# EAGLE design schematic (EAGLE 9.6.2)
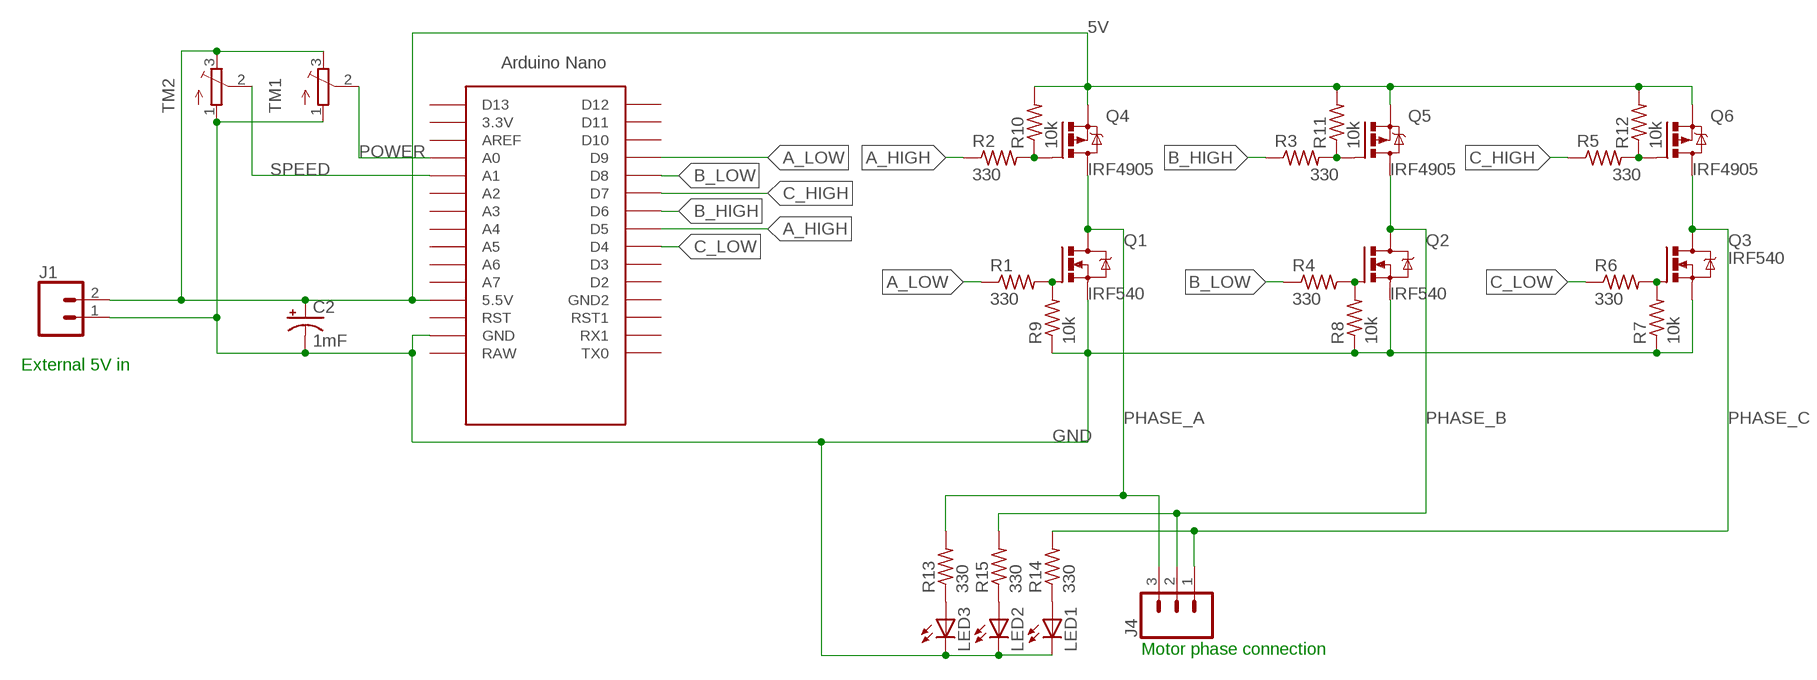
[diagram p0: schematic, sheet 1]

## Parts
C2  1mF  1000UF-RADIAL-5MM-25V-20%  [CPOL-RADIAL-5MM-10MM]
J1  CONN_025MM  [SCREWTERMINAL-5MM-2]
J4  CONN_03-SCREW-5MM  [SCREWTERMINAL-5MM-3]
LED1  LED5MM  [LED5MM]
LED2  LED5MM  [LED5MM]
LED3  LED5MM  [LED5MM]
Q1  IRF540  [TO220BV]
Q2  IRF540  [TO220BV]
Q3  IRF540  [TO220BV]
Q4  IRF4905  [TO220BH]
Q5  IRF4905  [TO220BH]
Q6  IRF4905  [TO220BH]
R1  330  R-US_0204/5  [0204/5]
R2  330  R-US_0204/5  [0204/5]
R3  330  R-US_0204/5  [0204/5]
R4  330  R-US_0204/5  [0204/5]
R5  330  R-US_0204/5  [0204/5]
R6  330  R-US_0204/5  [0204/5]
R7  10k  R-US_0204/5  [0204/5]
R8  10k  R-US_0204/5  [0204/5]
R9  10k  R-US_0204/5  [0204/5]
R10  10k  R-US_0204/5  [0204/5]
R11  10k  R-US_0204/5  [0204/5]
R12  10k  R-US_0204/5  [0204/5]
R13  330  R-US_0204/5  [0204/5]
R14  330  R-US_0204/5  [0204/5]
R15  330  R-US_0204/5  [0204/5]
TM1  TRIMPOT3386  [TRIM-3386]
TM2  TRIMPOT3386  [TRIM-3386]
U$1  NANO  [NANO]

## Nets
5V: C2.+ J1.2 Q4.S Q5.S Q6.S R10.2 R11.2 R12.2 TM1.3(E) TM2.3(E) U$1.5V(5.5V)
A_HIGH: R2.1 U$1.D5
A_LOW: R1.1 U$1.D9
B_HIGH: R3.1 U$1.D6
B_LOW: R4.1 U$1.D8
C_HIGH: R5.1 U$1.D7
C_LOW: R6.1 U$1.D4
GND: C2.- J1.1 LED1.K(C) LED2.K(C) LED3.K(C) Q1.S Q2.S Q3.S R7.1 R8.1 R9.1 TM1.1(A) TM2.1(A) U$1.GND
N$1: Q1.G R1.2 R9.2
N$2: Q4.G R2.2 R10.1
N$3: Q5.G R3.2 R11.1
N$4: Q2.G R4.2 R8.2
N$5: Q6.G R5.2 R12.1
N$6: Q3.G R6.2 R7.2
N$12: LED1.A R14.1
N$13: LED2.A R15.1
N$20: LED3.A R13.1
PHASE_A: J4.3 Q1.D Q4.D R13.2
PHASE_B: J4.2 Q2.D Q5.D R15.2
PHASE_C: J4.1 Q3.D Q6.D R14.2
POWER: TM1.2(S) U$1.A0
SPEED: TM2.2(S) U$1.A1
Unconnected: U$1.3.3V U$1.A2 U$1.A3 U$1.A4 U$1.A5 U$1.A6 U$1.A7 U$1.AREF U$1.D2 U$1.D3 U$1.D10 U$1.D11 U$1.D12 U$1.D13 U$1.GND1(GND2) U$1.ICSP1 U$1.ICSP2 U$1.ICSP3 U$1.ICSP4 U$1.ICSP5 U$1.ICSP6 U$1.RAW U$1.RST U$1.RST1 U$1.RX1 U$1.TX0

## Notes on the sheet
- External 5V in
- Motor phase connection

## Library data of the parts
C2 = SparkFun-Capacitors:1000UF: 1,000µF/1mF ceramic capacitors A capacitor is a passive two-terminal electrical component used to store electrical energy temporarily in an electric field. CAP-08070; PROD_ID: CAP-09538
J1 = SparkFun-Connectors:CONN_02: Multi connection point. Often used as Generic Header-pin footprint for 0.1 inch spaced/style header connections On any of the 0.1 inch spaced packages, you can populate with these: Break Away Headers - Straight <https://www.sparkfun.com/products/116> (PRT-00116) Break Away Male Headers - Right Angle <https://www.sparkfun.com/products/553> (PRT-00553) Female Headers <https://www.sparkfun.com/products/115> (PRT-00115) Break Away Headers - Machine Pin <https://www.sparkfun.com/products/117> (PRT-00117) Break Away Female Headers - Swiss Machine Pin <https://www.sparkfun.com/products/743> (PRT-00743) For SCREWTERMINALS and SPRING TERMINALS visit here: Screw Terimnals on SparkFun.com <https://www.sparkfun.com/search/results?term=Screw+Terminals> (5mm/3.5mm/2.54mm spacing) This device is also useful as a general connection point to wire up your design to another part of your project. Our various solder wires solder well into these plated through hole pads. Hook-Up Wire - Assortment (Stranded, 22 AWG) <https://www.sparkfun.com/products/11375> (PRT-11375) Hook-Up Wire - Assortment (Solid Core, 22 AWG) <https://www.sparkfun.com/products/11367> (PRT-11367) View the entire wire category on our website here <https://www.sparkfun.com/categories/141> Special notes: Molex polarized connector foot print use with: PRT-08233 with associated crimp pins and housings. 2.54_SCREWTERM for use with PRT-10571. 3.5mm Screw Terminal footprints for PRT-08084 5mm Screw Terminal footprints for use with PRT-08432; SF_SKU: PRT-08432
J4 = SparkFun-Connectors:CONN_03: Multi connection point. Often used as Generic Header-pin footprint for 0.1 inch spaced/style header connections On any of the 0.1 inch spaced packages, you can populate with these: Break Away Headers - Straight <https://www.sparkfun.com/products/116> (PRT-00116) Break Away Male Headers - Right Angle <https://www.sparkfun.com/products/553> (PRT-00553) Female Headers <https://www.sparkfun.com/products/115> (PRT-00115) Break Away Headers - Machine Pin <https://www.sparkfun.com/products/117> (PRT-00117) Break Away Female Headers - Swiss Machine Pin <https://www.sparkfun.com/products/743> (PRT-00743) Stackable Header - 3 Pin (Female, 0.1") <https://www.sparkfun.com/products/13875> (PRT-13875) For SCREWTERMINALS and SPRING TERMINALS visit here: Screw Terimnals on SparkFun.com <https://www.sparkfun.com/search/results?term=Screw+Terminals> (5mm/3.5mm/2.54mm spacing) This device is also useful as a general connection point to wire up your design to another part of your project. Our various solder wires solder well into these plated through hole pads. Hook-Up Wire - Assortment (Stranded, 22 AWG) <https://www.sparkfun.com/products/11375> (PRT-11375) Hook-Up Wire - Assortment (Solid Core, 22 AWG) <https://www.sparkfun.com/products/11367> (PRT-11367) View the entire wire category on our website here <https://www.sparkfun.com/categories/141> Special notes: Molex polarized connector foot print use with SKU : PRT-08232 with associated crimp pins and housings.; PROD_ID: CONN-10134; SF_SKU: PRT-08433
LED1-LED3 = adafruit:LED: LED OSRAM: - CHIPLED LG R971, LG N971, LY N971, LG Q971, LY Q971, LO R971, LY R971 LH N974, LH R974 LS Q976, LO Q976, LY Q976 LO Q996 - Hyper CHIPLED LW Q18S LB Q993, LB Q99A, LB R99A - SideLED LS A670, LO A670, LY A670, LG A670, LP A670 LB A673, LV A673, LT A673, LW A673 LH A674 LY A675 LS A676, LA A676, LO A676, LY A676, LW A676 LS A679, LY A679, LG A679 - Hyper Micro SIDELED® LS Y876, LA Y876, LO Y876, LY Y876 LT Y87S - SmartLED LW L88C, LW L88S LB L89C, LB L89S, LG L890 LS L89K, LO L89K, LY L89K LS L896, LA L896, LO L896, LY L896 - TOPLED LS T670, LO T670, LY T670, LG T670, LP T670 LSG T670, LSP T670, LSY T670, LOP T670, LYG T670 LG T671, LOG T671, LSG T671 LB T673, LV T673, LT T673, LW T673 LH T674 LS T676, LA T676, LO T676, LY T676, LB T676, LH T676, LSB T676, LW T676 LB T67C, LV T67C, LT T67C, LS T67K, LO T67K, LY T67K, LW E67C LS E67B, LA E67B, LO E67B, LY E67B, LB E67C, LV E67C, LT E67C LW T67C LS T679, LY T679, LG T679 LS T770, LO T770, LY T770, LG T770, LP T770 LB T773, LV T773, LT T773, LW T773 LH T774 LS E675, LA E675, LY E675, LS T675 LS T776, LA T776, LO T776, LY T776, LB T776 LHGB T686 LT T68C, LB T68C - Hyper Mini TOPLED® LB M676 - Mini TOPLED Santana® LG M470 LS M47K, LO M47K, LY M47K Source: http://www.osram.convergy.de/
Q1-Q3 = transistor-power:IRF540: HEXFET Power MOSFET
Q4-Q6 = transistor-power:IRF4905: P-Channel HEXFET® Power MOSFET RDS(on)= 0.02 Ohm, ID = -74A Source: http://www.irf.com/product-info/datasheets/data/irf4905pbf.pdf
R1-R15 = adafruit:R-US_: RESISTOR, American symbol
TM1 TM2 = adafruit:TRIMPOT: SMT trimmer potentiometer part number TC33X http://www.ladyada.net/library/eagle
U$1 = Arduino-clone:NANO: Arduino Nano

## Board
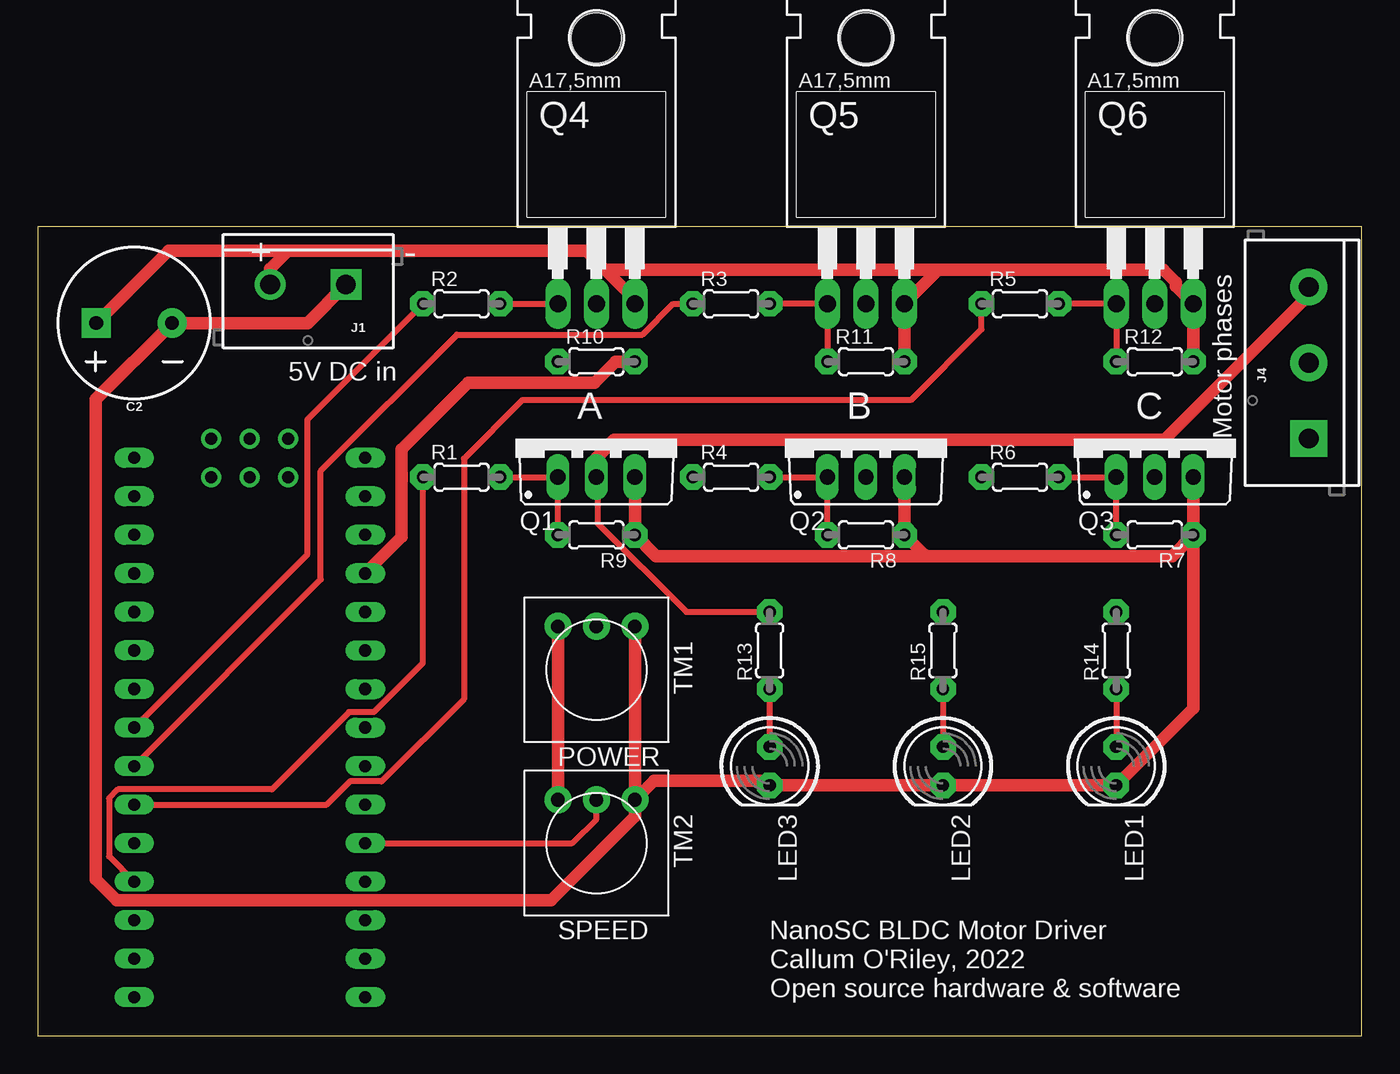
[diagram p1: board, top side]
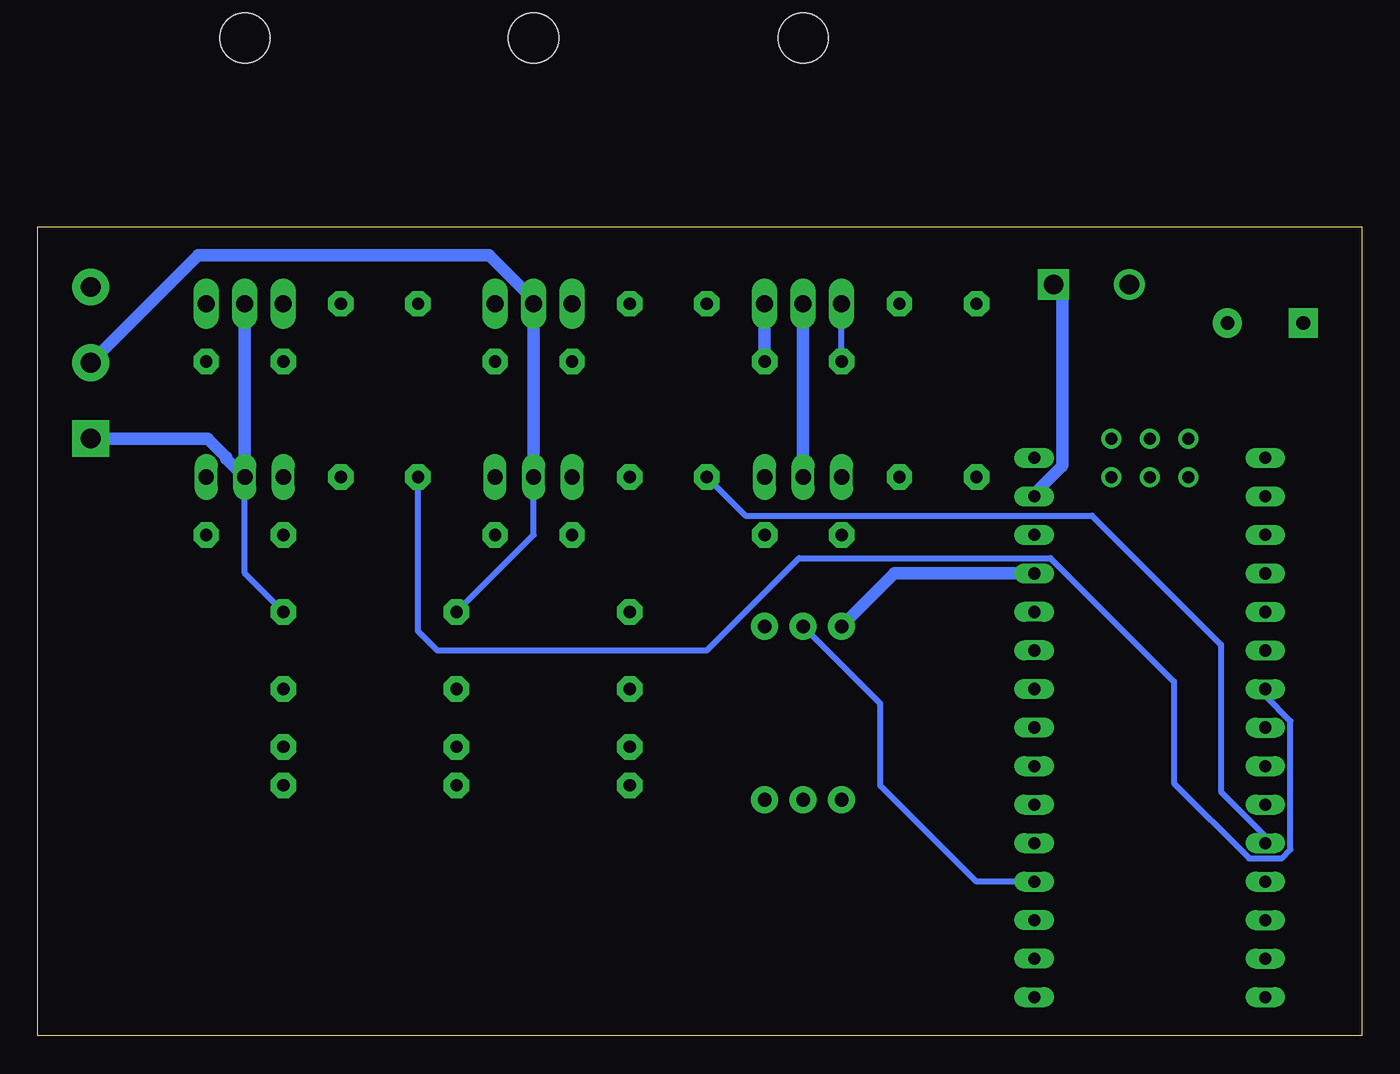
[diagram p2: board, bottom side, seen from below]

Size 87.3 x 53.33 mm. Coordinates in mm from the lower left corner, seen from the top.
Outline: 0,0 87.3,0 87.3,53.33 0,53.33 0,0
Copper layers (1*16): Top 0.035mm / dielectric 1.5mm / Bottom 0.035mm
Design rules "default": minimum track width 6mil, minimum drill 0.35mm, track to track 6mil, track to pad 6mil, pad to pad 6mil, via to via 6mil, smd to smd 6mil, copper to edge 40mil, drill to drill 6mil, minimum pad ring 10mil, minimum via ring 8mil, stop-mask expansion 4mil, vias tented up to drill 0mil, thermal gap 10mil

### Footprints (pad centres in the part's own frame; a part is rotated, then mirrored left to right if it is on the bottom)
CPOL-RADIAL-5MM-10MM = drill 0.9 pad 1.93 square: + 2.5,0 | drill 0.9 pad 1.93: - -2.5,0
SCREWTERMINAL-5MM-2 = drill 1.3 pad 2.032 square: 1 0,0 | drill 1.3 pad 2.032: 2 5,0
SCREWTERMINAL-5MM-3 = drill 1.3 pad 2.413 square: 1 0,0 | drill 1.3 pad 2.413: 2 5,0; 3 10,0
LED5MM = drill 0.813 pad 1.676 octagon: A -1.27,0; K 1.27,0
TO220BV = drill 1.016 long: D 0,-2.54; G -2.54,-2.54; S 2.54,-2.54
TO220BH = drill 1.118 long: D 0,-6.35; G -2.54,-6.35; S 2.54,-6.35 | hole 3.302: 0,11.176
0204/5 = drill 0.813 pad 1.676 octagon: 1 -2.54,0; 2 2.54,0
TRIM-3386 = drill 0.9 pad 1.778: 1 -2.54,-2.857; 2 0,-2.857; 3 2.54,-2.857
NANO = drill 0.8 long: 3.3V -10.16,24.13; 5V -10.16,-1.27; A0 -10.16,19.05; A1 -10.16,16.51; A2 -10.16,13.97; A3 -10.16,11.43; A4 -10.16,8.89; A5 -10.16,6.35; A6 -10.16,3.81; A7 -10.16,1.27; AREF -10.16,21.59; D2 5.08,1.27; D3 5.08,3.81; D4 5.08,6.35; D5 5.08,8.89; D6 5.08,11.43; D7 5.08,13.97; D8 5.08,16.51; D9 5.08,19.05; D10 5.08,21.59; D11 5.08,24.13; D12 5.08,26.67; D13 -10.16,26.67; GND -10.16,-6.35; GND1 5.08,-1.27; RAW -10.16,-8.89; RST -10.16,-3.81; RST1 5.08,-3.81; RX1 5.08,-6.35; TX0 5.08,-8.89 | drill 0.8: ICSP1 -5.08,-10.16; ICSP2 -5.08,-7.62; ICSP3 -2.54,-10.16; ICSP4 -2.54,-7.62; ICSP5 0,-10.16; ICSP6 0,-7.62

### Placement (x,y rotation side)
C2  6.35,46.99 180 top
J1  20.32,49.53 180 top
J4  83.82,39.37 90 top
LED1  71.12,17.78 270 top
LED2  59.69,17.78 270 top
LED3  48.26,17.78 270 top
Q1  36.83,39.37 0 top
Q2  54.61,39.37 0 top
Q3  73.66,39.37 0 top
Q4  36.83,54.61 0 top
Q5  54.61,54.61 0 top
Q6  73.66,54.61 0 top
R1  27.94,36.83 0 top
R2  27.94,48.26 0 top
R3  45.72,48.26 0 top
R4  45.72,36.83 0 top
R5  64.77,48.26 0 top
R6  64.77,36.83 0 top
R7  73.66,33.02 180 top
R8  54.61,33.02 180 top
R9  36.83,33.02 180 top
R10  36.83,44.45 0 top
R11  54.61,44.45 0 top
R12  73.66,44.45 0 top
R13  48.26,25.4 90 top
R14  71.12,25.4 90 top
R15  59.69,25.4 90 top
TM1  36.83,24.13 180 top
TM2  36.83,12.7 180 top
U$1  11.43,29.21 180 top

### Tracks (layer width: path | path; a pad name or v marks a point on that pad's centre or on a via)
5V
  Top 0.813: Q4.S 39.37,48.53 37.41,50.49 | R11.2 Q5.S 59.38,50.49 | R12.2 Q6.S 75.06,49.4 75.06,49.68 74.24,50.49 59.38,50.49 | 37.41,50.49 59.38,50.49 | C2.+ 8.62,51.77 16.51,51.77 | R10.2 38.1,44.45 36.7,43.05 28.38,43.05 24,38.68 24,32.89 U$1.5V | TM2.3 TM1.3 | 37.41,50.49 36.14,51.77 16.51,51.77 | 16.51,51.77 15.32,50.58 J1.2
  Bottom 0.813: Q4.S R10.2 | U$1.5V 30.8,30.48 TM1.3
A_HIGH
  Top 0.406: U$1.D5 17.78,31.75 17.78,40.64 R2.1
A_LOW
  Top 0.406: U$1.D9 4.69,11.82 4.69,15.66 5.28,16.25 15.44,16.25 20.52,21.33 22.14,21.33 25.4,24.59 R1.1
B_HIGH
  Top 0.406: R3.1 41.9,48.26 39.86,46.23 27.64,46.23 18.66,37.25 18.66,30.09 U$1.D6
B_LOW
  Bottom 0.406: R4.1 40.64,34.29 17.78,34.29 9.28,25.79 9.28,16.09 6.35,13.16 U$1.D8
C_HIGH
  Top 0.406: R5.1 62.23,46.57 57.57,41.91 31.95,41.91 28.09,38.05 28.09,22.2 22.66,16.77 20.58,16.77 19.05,15.24 U$1.D7
C_LOW
  Bottom 0.406: R6.1 62.23,26.67 60.96,25.4 43.18,25.4 37.09,31.49 20.52,31.49 12.38,23.35 12.38,16.65 7.42,11.69 5.28,11.69 4.69,12.28 4.69,20.74 6.35,22.4 U$1.D4
GND
  Top 0.813: Q1.S R9.1 40.77,31.62 58.42,31.62 | Q3.S R7.1 | Q2.S R8.1 58.42,31.75 58.42,31.62 | 58.42,31.62 74.8,31.62 R7.1 | R7.1 76.2,21.59 LED1.K LED2.K LED3.K 47.94,16.83 40.64,16.83 TM2.1 | TM2.1 TM1.1 | TM2.1 39.37,14.48 33.84,8.95 5.19,8.95 3.81,10.33 3.81,41.95 C2.- 17.78,46.99 J1.1
  Bottom 0.813: U$1.GND 21.59,35.73 19.77,37.55 19.72,37.6 19.72,48.93 J1.1
N$1
  Top 0.406: R1.2 Q1.G R9.2
N$2
  Top 0.406: R2.2 Q4.G
  Bottom 0.406: R10.1 Q4.G
N$3
  Top 0.406: R11.1 Q5.G R3.2
N$4
  Top 0.406: R4.2 Q2.G R8.2
N$5
  Top 0.406: R12.1 Q6.G R5.2
N$6
  Top 0.406: R6.2 Q3.G R7.2
N$12
  Top 0.406: R14.1 LED1.A
N$13
  Top 0.406: R15.1 LED2.A
N$20
  Top 0.406: R13.1 LED3.A
PHASE_A
  Top 0.406: Q1.D 36.91,36.75 36.91,33.8 42.76,27.94 R13.2
  Top 0.813: Q1.D 36.83,38.1 38.01,39.28 74.28,39.28 83.82,48.82 J4.3
  Bottom 0.813: Q1.D Q4.D
PHASE_B
  Bottom 0.406: R15.2 54.61,33.02 Q2.D
  Bottom 0.813: Q2.D Q5.D 54.61,48.53 57.54,51.46 74.93,51.46 75.81,51.46 76.73,51.46 J4.2
PHASE_C
  Bottom 0.406: R14.2 73.66,30.48 Q3.D
  Bottom 0.813: Q6.D Q3.D 74.88,38.05 74.88,38.14 76.11,39.37 J4.1
POWER
  Bottom 0.406: U$1.A0 25.4,10.16 31.75,16.51 31.75,21.91 TM1.2
SPEED
  Top 0.406: U$1.A1 35.24,12.7 36.83,14.29 TM2.2

### Text on the board
tNames: + | - | 5V DC in | A | B | C | Motor phases | POWER | SPEED | NanoSC BLDC Motor Driver / Callum O'Riley, 2022 / Open source hardware & software